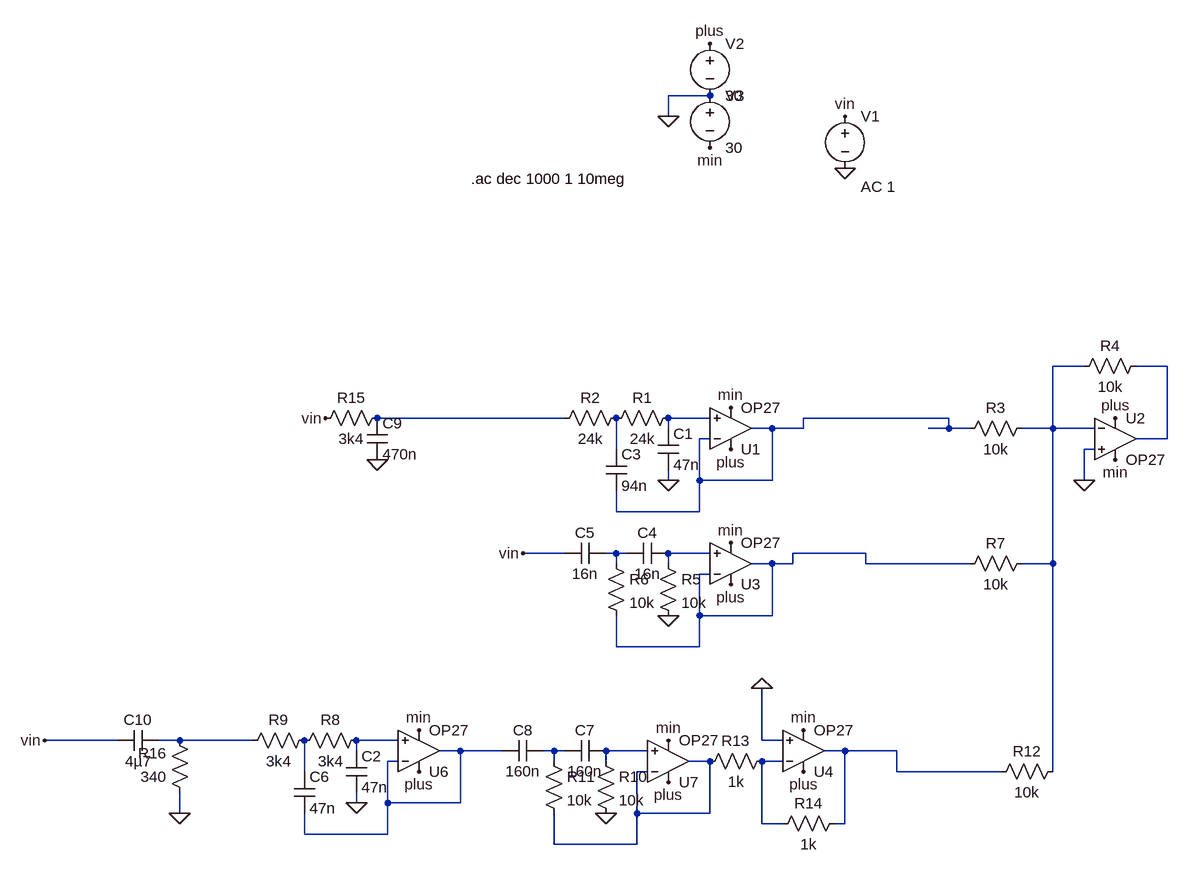
[diagram p0: schematic Draft1.asc]
Draft1.asc, the LTspice schematic file:
Version 4.1
SHEET 1 900 896
WIRE 192 -368 128 -368
WIRE 128 -336 128 -368
WIRE 768 48 720 48
WIRE 896 48 848 48
WIRE -32 128 -320 128
WIRE 192 128 128 128
WIRE 560 128 336 128
WIRE 128 144 128 128
WIRE 288 144 256 144
WIRE 336 144 336 128
WIRE 336 144 288 144
WIRE 560 144 560 128
WIRE 560 144 528 144
WIRE 592 144 560 144
WIRE 720 144 720 48
WIRE 720 144 672 144
WIRE 784 144 720 144
WIRE 192 160 176 160
WIRE 896 160 896 48
WIRE 896 160 848 160
WIRE 48 176 48 128
WIRE 784 176 768 176
WIRE 128 224 128 208
WIRE 176 224 176 160
WIRE 288 224 288 144
WIRE 288 224 176 224
WIRE 768 224 768 176
WIRE 48 272 48 240
WIRE 176 272 176 224
WIRE 176 272 48 272
WIRE -32 336 -96 336
WIRE 48 336 32 336
WIRE 64 336 48 336
WIRE 192 336 128 336
WIRE 432 336 320 336
WIRE 48 352 48 336
WIRE 128 352 128 336
WIRE 288 352 256 352
WIRE 320 352 320 336
WIRE 320 352 288 352
WIRE 432 352 432 336
WIRE 592 352 432 352
WIRE 720 352 720 144
WIRE 720 352 672 352
WIRE 192 368 176 368
WIRE 176 432 176 368
WIRE 288 432 288 352
WIRE 288 432 176 432
WIRE 48 480 48 432
WIRE 176 480 176 432
WIRE 176 480 48 480
WIRE -720 624 -832 624
WIRE -624 624 -656 624
WIRE -512 624 -624 624
WIRE -288 624 -352 624
WIRE 272 624 272 544
WIRE 304 624 272 624
WIRE -352 640 -352 624
WIRE -192 640 -224 640
WIRE -128 640 -192 640
WIRE -48 640 -64 640
WIRE -32 640 -48 640
WIRE 96 640 32 640
WIRE 400 640 368 640
WIRE 480 640 400 640
WIRE -288 656 -304 656
WIRE -48 656 -48 640
WIRE 32 656 32 640
WIRE 192 656 160 656
WIRE 304 656 272 656
WIRE -432 672 -432 624
WIRE 96 672 80 672
WIRE 480 672 480 640
WIRE 640 672 480 672
WIRE 720 672 720 352
WIRE -352 720 -352 704
WIRE -304 720 -304 656
WIRE -192 720 -192 640
WIRE -192 720 -304 720
WIRE -624 736 -624 704
WIRE 80 736 80 672
WIRE 192 736 192 656
WIRE 192 736 80 736
WIRE 272 752 272 656
WIRE 304 752 272 752
WIRE 400 752 400 640
WIRE 400 752 384 752
WIRE -432 768 -432 736
WIRE -304 768 -304 720
WIRE -304 768 -432 768
WIRE -48 784 -48 736
WIRE 80 784 80 736
WIRE 80 784 -48 784
FLAG 400 -256 0
FLAG 128 -336 0
FLAG 192 -288 min
FLAG 224 112 min
FLAG 192 -448 plus
FLAG 224 176 plus
FLAG 128 224 0
FLAG 768 224 0
FLAG 816 128 plus
FLAG 816 192 min
FLAG 224 320 min
FLAG 224 384 plus
FLAG 128 432 0
FLAG 400 -336 vin
FLAG -96 336 vin
FLAG -256 608 min
FLAG -256 672 plus
FLAG -352 720 0
FLAG 128 624 min
FLAG 128 688 plus
FLAG 32 736 0
FLAG -832 624 vin
FLAG -400 128 vin
FLAG 336 608 min
FLAG 336 672 plus
FLAG 272 544 0
FLAG -320 192 0
FLAG -624 736 0
SYMBOL OpAmps\\OP27 224 208 M180
SYMATTR InstName U1
SYMBOL cap 112 144 R0
SYMATTR InstName C1
SYMATTR Value 47n
SYMBOL res 144 112 R90
WINDOW 0 0 56 VBottom 2
WINDOW 3 32 56 VTop 2
SYMATTR InstName R1
SYMATTR Value 24k
SYMBOL res 64 112 R90
WINDOW 0 0 56 VBottom 2
WINDOW 3 32 56 VTop 2
SYMATTR InstName R2
SYMATTR Value 24k
SYMBOL voltage 400 -352 R0
WINDOW 123 24 124 Left 2
WINDOW 39 0 0 Left 0
SYMATTR InstName V1
SYMATTR Value ""
SYMATTR Value2 AC 1
SYMBOL voltage 192 -464 R0
WINDOW 123 0 0 Left 0
WINDOW 39 0 0 Left 0
SYMATTR InstName V2
SYMATTR Value 30
SYMBOL voltage 192 -384 R0
WINDOW 123 0 0 Left 0
WINDOW 39 0 0 Left 0
SYMATTR InstName V3
SYMATTR Value 30
SYMBOL cap 32 176 R0
SYMATTR InstName C3
SYMATTR Value 94n
SYMBOL res 688 128 R90
WINDOW 0 0 56 VBottom 2
WINDOW 3 32 56 VTop 2
SYMATTR InstName R3
SYMATTR Value 10k
SYMBOL OpAmps\\OP27 816 96 R0
SYMATTR InstName U2
SYMBOL res 864 32 R90
WINDOW 0 0 56 VBottom 2
WINDOW 3 32 56 VTop 2
SYMATTR InstName R4
SYMATTR Value 10k
SYMBOL OpAmps\\OP27 224 416 M180
SYMATTR InstName U3
SYMBOL res 688 336 R90
WINDOW 0 0 56 VBottom 2
WINDOW 3 32 56 VTop 2
SYMATTR InstName R7
SYMATTR Value 10k
SYMBOL res 112 336 R0
SYMATTR InstName R5
SYMATTR Value 10k
SYMBOL res 32 336 R0
SYMATTR InstName R6
SYMATTR Value 10k
SYMBOL cap 128 320 R90
WINDOW 0 0 32 VBottom 2
WINDOW 3 32 32 VTop 2
SYMATTR InstName C4
SYMATTR Value 16n
SYMBOL cap 32 320 R90
WINDOW 0 0 32 VBottom 2
WINDOW 3 32 32 VTop 2
SYMATTR InstName C5
SYMATTR Value 16n
SYMBOL OpAmps\\OP27 -256 704 M180
SYMATTR InstName U6
SYMBOL cap -368 640 R0
SYMATTR InstName C2
SYMATTR Value 47n
SYMBOL res -336 608 R90
WINDOW 0 0 56 VBottom 2
WINDOW 3 32 56 VTop 2
SYMATTR InstName R8
SYMATTR Value 3k4
SYMBOL res -416 608 R90
WINDOW 0 0 56 VBottom 2
WINDOW 3 32 56 VTop 2
SYMATTR InstName R9
SYMATTR Value 3k4
SYMBOL cap -448 672 R0
SYMATTR InstName C6
SYMATTR Value 47n
SYMBOL OpAmps\\OP27 128 720 M180
SYMATTR InstName U7
SYMBOL res 16 640 R0
SYMATTR InstName R10
SYMATTR Value 10k
SYMBOL res -64 640 R0
SYMATTR InstName R11
SYMATTR Value 10k
SYMBOL cap 32 624 R90
WINDOW 0 0 32 VBottom 2
WINDOW 3 32 32 VTop 2
SYMATTR InstName C7
SYMATTR Value 160n
SYMBOL cap -64 624 R90
WINDOW 0 0 32 VBottom 2
WINDOW 3 32 32 VTop 2
SYMATTR InstName C8
SYMATTR Value 160n
SYMBOL res 736 656 R90
WINDOW 0 0 56 VBottom 2
WINDOW 3 32 56 VTop 2
SYMATTR InstName R12
SYMATTR Value 10k
SYMBOL OpAmps\\OP27 336 704 M180
SYMATTR InstName U4
SYMBOL res 288 640 R90
WINDOW 0 0 56 VBottom 2
WINDOW 3 32 56 VTop 2
SYMATTR InstName R13
SYMATTR Value 1k
SYMBOL res 400 736 R90
WINDOW 0 0 56 VBottom 2
WINDOW 3 32 56 VTop 2
SYMATTR InstName R14
SYMATTR Value 1k
SYMBOL res -304 112 R90
WINDOW 0 0 56 VBottom 2
WINDOW 3 32 56 VTop 2
SYMATTR InstName R15
SYMATTR Value 3k4
SYMBOL cap -336 128 R0
SYMATTR InstName C9
SYMATTR Value 470n
SYMBOL res -608 720 R180
WINDOW 0 36 76 Left 2
WINDOW 3 36 40 Left 2
SYMATTR InstName R16
SYMATTR Value 340
SYMBOL cap -656 608 R90
WINDOW 0 0 32 VBottom 2
WINDOW 3 32 32 VTop 2
SYMATTR InstName C10
SYMATTR Value 4µ7
TEXT -176 -240 Left 2 !.ac dec 1000 1 10meg

The netlist it stands for:
* Draft1.asc
X§U1 N004 N005 plus min N005 OP27  ; pins In+ In- V+ V- OUT
C1 N004 0 47n
R1 N004 N006 24k
R2 N006 N003 24k
V1 vin 0 AC 1
V2 plus 0 30
V3 0 min 30
C3 N006 N005 94n
R3 N001 N005 10k
X§U2 0 N001 plus min N002 OP27  ; pins In+ In- V+ V- OUT
R4 N002 N001 10k
X§U3 N008 N009 plus min N009 OP27  ; pins In+ In- V+ V- OUT
R7 N001 N009 10k
R5 N008 0 10k
R6 N007 N009 10k
C4 N008 N007 16n
C5 N007 vin 16n
X§U6 N011 N012 plus min N012 OP27  ; pins In+ In- V+ V- OUT
C2 N011 0 47n
R8 N011 N018 3k4
R9 N018 N010 3k4
C6 N018 N012 47n
X§U7 N014 N016 plus min N016 OP27  ; pins In+ In- V+ V- OUT
R10 N014 0 10k
R11 N013 N016 10k
C7 N014 N013 160n
C8 N013 N012 160n
R12 N001 N015 10k
X§U4 0 N017 plus min N015 OP27  ; pins In+ In- V+ V- OUT
R13 N017 N016 1k
R14 N015 N017 1k
R15 N003 vin 3k4
C9 N003 0 470n
R16 0 N010 340
C10 N010 vin 4µ7
.ac dec 1000 1 10meg
.lib ADI.lib
.backanno
.end